# Altium schematic sheet radio.SchDoc
size A4
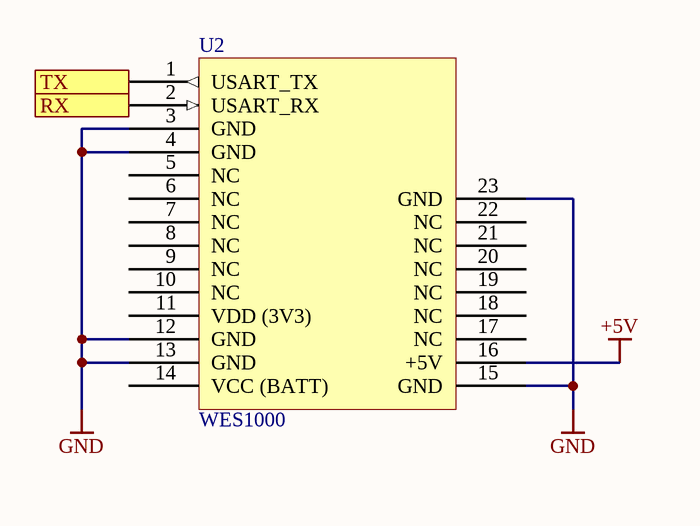
[diagram p0: radio.SchDoc]

## Parts
U2  WES1000  [FP_WES1000]

## Ports
RX (in), TX (out)

## Nets
+5V: U2.16(+5V)
GND: U2.3(GND) U2.4(GND) U2.12(GND) U2.13(GND) U2.15(GND) U2.23(GND)
RX: U2.2(USART_RX) ; port RX
TX: U2.1(USART_TX) ; port TX

Not connected (* = marked no-connect by the designer): U2 5(NC) 6(NC) 7(NC) 8(NC) 9(NC) 10(NC) 11(VDD_(3V3)) 14(VCC_(BATT)) 17(NC) 18(NC) 19(NC) 20(NC) 21(NC) 22(NC)

## Library data of the parts
U2 = WES1000: SiLabs vezeték nélküli modul